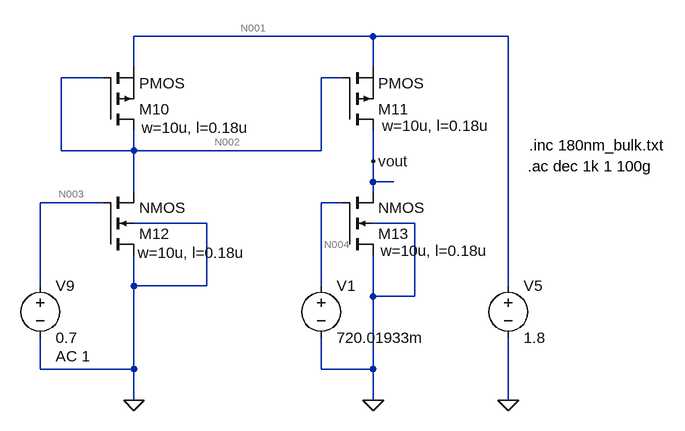
[diagram p0: schematic hmw3.asc]
hmw3.asc, the LTspice schematic file:
Version 4
SHEET 1 1020 680
WIRE 416 48 48 48
WIRE 624 48 416 48
WIRE 48 96 48 48
WIRE 416 96 416 48
WIRE 0 112 -64 112
WIRE 368 112 336 112
WIRE -64 224 -64 112
WIRE 48 224 48 192
WIRE 48 224 -64 224
WIRE 336 224 336 112
WIRE 336 224 48 224
WIRE 416 240 416 192
WIRE 416 272 416 240
WIRE 448 272 416 272
WIRE 48 288 48 224
WIRE 416 288 416 272
WIRE 0 304 -96 304
WIRE 368 304 336 304
WIRE 160 336 48 336
WIRE 480 336 416 336
WIRE -96 432 -96 304
WIRE 48 432 48 384
WIRE 160 432 160 336
WIRE 160 432 48 432
WIRE 336 432 336 304
WIRE 624 432 624 48
WIRE 416 448 416 384
WIRE 480 448 480 336
WIRE 480 448 416 448
WIRE -96 560 -96 512
WIRE 48 560 48 432
WIRE 48 560 -96 560
WIRE 336 560 336 512
WIRE 416 560 416 448
WIRE 416 560 336 560
WIRE 48 608 48 560
WIRE 416 608 416 560
WIRE 624 608 624 512
FLAG 416 608 0
FLAG 48 608 0
FLAG 624 608 0
FLAG 416 240 vout
DATAFLAG 448 272 ""
SYMBOL voltage 336 416 R0
WINDOW 123 0 0 Left 0
WINDOW 39 0 0 Left 0
SYMATTR InstName V1
SYMATTR Value 720.01933m
SYMBOL voltage -96 416 R0
WINDOW 123 24 124 Left 2
WINDOW 39 0 0 Left 0
SYMATTR Value2 AC 1
SYMATTR InstName V9
SYMATTR Value 0.7
SYMBOL voltage 624 416 R0
SYMATTR InstName V5
SYMATTR Value 1.8
SYMBOL pmos 0 192 M180
WINDOW 123 60 3 Left 2
SYMATTR Value2 w=10u, l=0.18u
SYMATTR InstName M10
SYMBOL pmos 368 192 M180
WINDOW 123 62 6 Left 2
SYMATTR InstName M11
SYMATTR Value2 w=10u, l=0.18u
SYMBOL nmos4 0 384 M180
WINDOW 123 54 3 Left 2
SYMATTR InstName M12
SYMATTR Value2 w=10u, l=0.18u
SYMBOL nmos4 368 384 M180
WINDOW 123 60 6 Left 2
SYMATTR Value2 w=10u, l=0.18u
SYMATTR InstName M13
TEXT 656 216 Left 2 !.inc 180nm_bulk.txt
TEXT 654 248 Left 2 !.ac dec 1k 1 100g

The netlist it stands for:
* hmw3.asc
V1 N004 0 720.01933m
V9 N003 0 0.7 AC 1
V5 N001 0 1.8
M10 N002 N002 N001 N001 PMOS w=10u, l=0.18u
M11 vout N002 N001 N001 PMOS w=10u, l=0.18u
M12 0 N003 N002 0 NMOS w=10u, l=0.18u
M13 0 N004 vout 0 NMOS w=10u, l=0.18u
.model NMOS NMOS
.model PMOS PMOS
.lib standard.mos
.inc 180nm_bulk.txt
.ac dec 1k 1 100g
.backanno
.end

* Results of the author's LTspice run, read from the files saved beside the schematic
* Operating Point, zero values left out:
*   V(n004) = 720 mV
*   V(n003) = 700 mV
*   V(n001) = 1.8 V
*   V(n002) = 852.3 mV
*   V(vout) = 740 mV
*   Id(M13) = -996.8 µA
*   Is(M13) = 996.8 µA
*   Id(M12) = -956.2 µA
*   Is(M12) = 956.2 µA
*   Id(M11) = -996.8 µA
*   Ib(M11) = 1.07 pA
*   Is(M11) = 996.8 µA
*   Id(M10) = -956.2 µA
*   Is(M10) = 956.2 µA
*   I(V5) = -1.953 mA